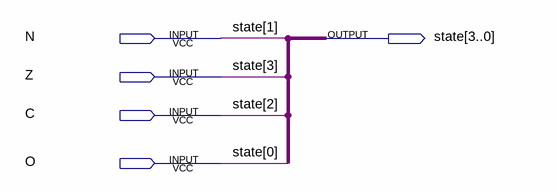
[diagram p0: schematic sheet]
// Quartus schematic state_bus.bdf as structural Verilog: 0 symbols, 5 pins
module state_bus (
  input  N,
  input  Z,
  input  C,
  input  O,
  output [3:0] state
);


  assign state = {Z, C, N, O};
endmodule
